# EAGLE design filterboard (EAGLE 5.11)
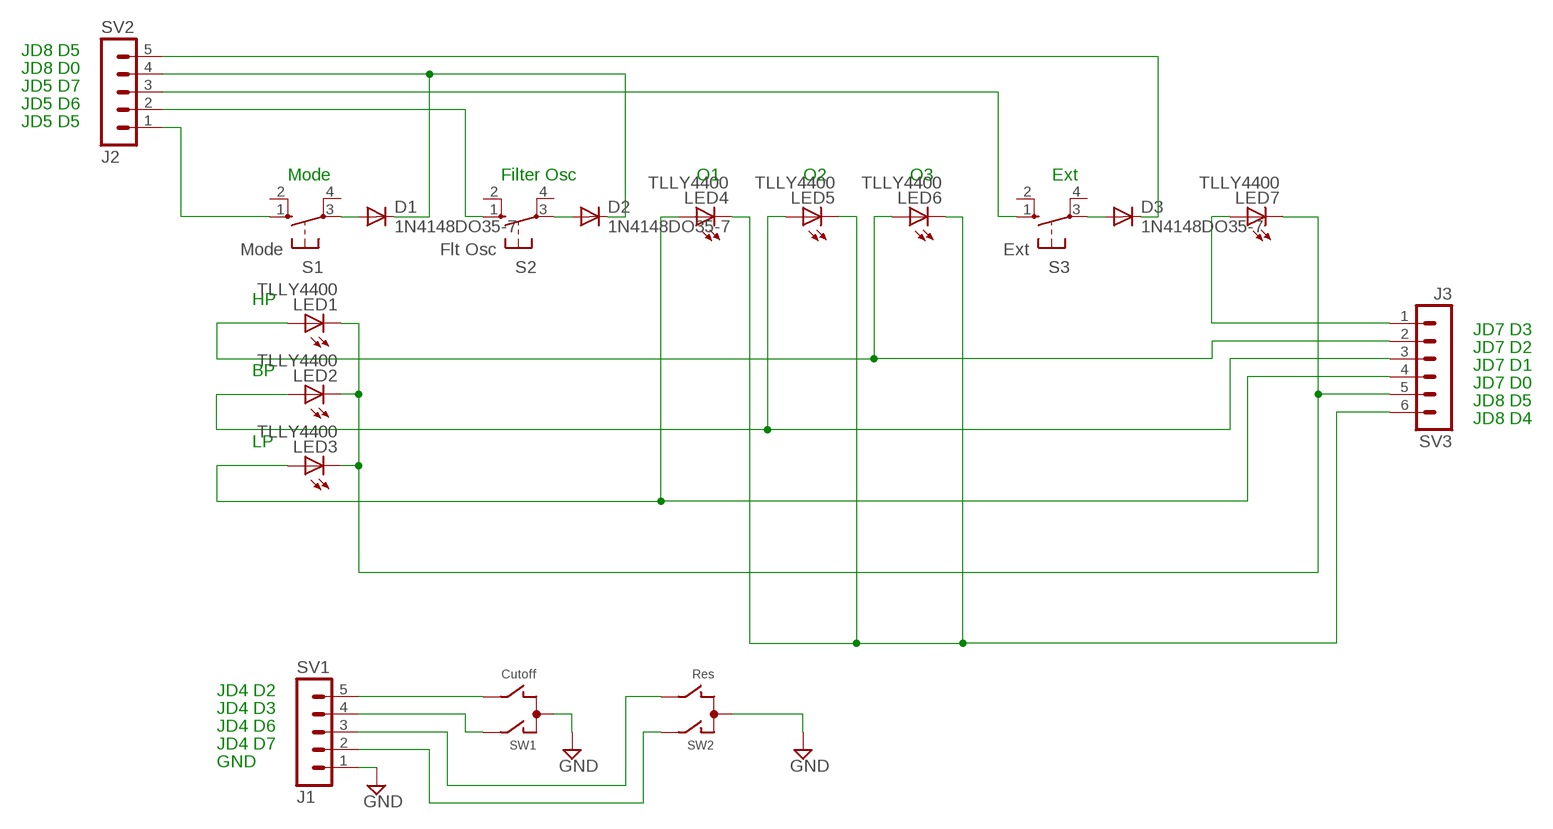
[diagram p0: schematic, sheet 1]

## Parts
D1  1N4148DO35-7  [DO35-7]
D2  1N4148DO35-7  [DO35-7]
D3  1N4148DO35-7  [DO35-7]
LED1  TLLY4400  [LED3MM]
LED2  TLLY4400  [LED3MM]
LED3  TLLY4400  [LED3MM]
LED4  TLLY4400  [LED3MM]
LED5  TLLY4400  [LED3MM]
LED6  TLLY4400  [LED3MM]
LED7  TLLY4400  [LED3MM]
S1  Mode  10-XX  [B3F-10XX]
S2  Flt Osc  10-XX  [B3F-10XX]
S3  Ext  10-XX  [B3F-10XX]
SV1  J1  MA05-1  [MA05-1]
SV2  J2  MA05-1  [MA05-1]
SV3  J3  MA06-1  [MA06-1]
SW1  Cutoff  EC12E_SW  [ALPS_EC12E_SW]
SW2  Res  EC12E_SW  [ALPS_EC12E_SW]

## Nets
GND: SV1.1 SW1.C SW2.C
N$1: SV1.5 SW1.B
N$2: SV1.4 SW1.A
N$3: SV1.3 SW2.B
N$4: SV1.2 SW2.A
N$5: S1.1(S) SV2.1
N$6: D1.A S1.3(P)
N$7: S2.1(S) SV2.2
N$8: S3.1(S) SV2.3
N$9: D1.C D2.C SV2.4
N$10: D2.A S2.3(P)
N$11: LED1.K(C) LED2.K(C) LED3.K(C) LED7.K(C) SV3.5
N$12: D3.A S3.3(P)
N$13: D3.C SV2.5
N$14: LED1.A LED6.A SV3.2
N$15: LED2.A LED5.A SV3.3
N$16: LED4.K(C) LED5.K(C) LED6.K(C) SV3.6
N$20: LED7.A SV3.1
N$24: LED3.A LED4.A SV3.4
Unconnected: S1.2(S1) S1.4(P1) S2.2(S1) S2.4(P1) S3.2(S1) S3.4(P1) SW1.D SW1.E SW1.GND1(G) SW1.GND2(G) SW2.D SW2.E SW2.GND1(G) SW2.GND2(G)

## Notes on the sheet
- JD8 D5
- JD8 D0
- JD5 D7
- JD5 D6
- JD5 D5
- Mode | Filter Osc | O1 | O2 | O3 | Ext
- HP
- JD7 D3
- JD7 D2
- JD7 D1
- BP | JD7 D0
- JD8 D5
- JD8 D4
- LP
- JD4 D2
- JD4 D3
- JD4 D6
- JD4 D7
- GND

## Library data of the parts
D1-D3 = diode:1N4148: DIODE high speed (Philips)
LED1-LED7 = led:TLLY4400: Low Current (2mA) LED 3 mm Tinted Diffused Package color YELLOW Source: Data sheet <http://www.farnell.com/datasheets/391098.pdf>; MF: VISHAY SEMICONDUCTOR; OC_FARNELL: 1612439
S1-S3 = switch-omron:10-XX: OMRON SWITCH; MPN: B3F-1000; OC_FARNELL: 176432; OC_NEWARK: 36M3542
SV1 SV2 = con-lstb:MA05-1: PIN HEADER; OC_FARNELL: unknown; OC_NEWARK: unknown
SV3 = con-lstb:MA06-1: PIN HEADER; OC_FARNELL: unknown; OC_NEWARK: unknown
SW1 SW2 = switch-alps:EC12E_SW: ALPS rotary Encoder EC12E series with switch; MPN: EC12E2424407; OC_FARNELL: 1520813; OC_NEWARK: 74M1068

## Board
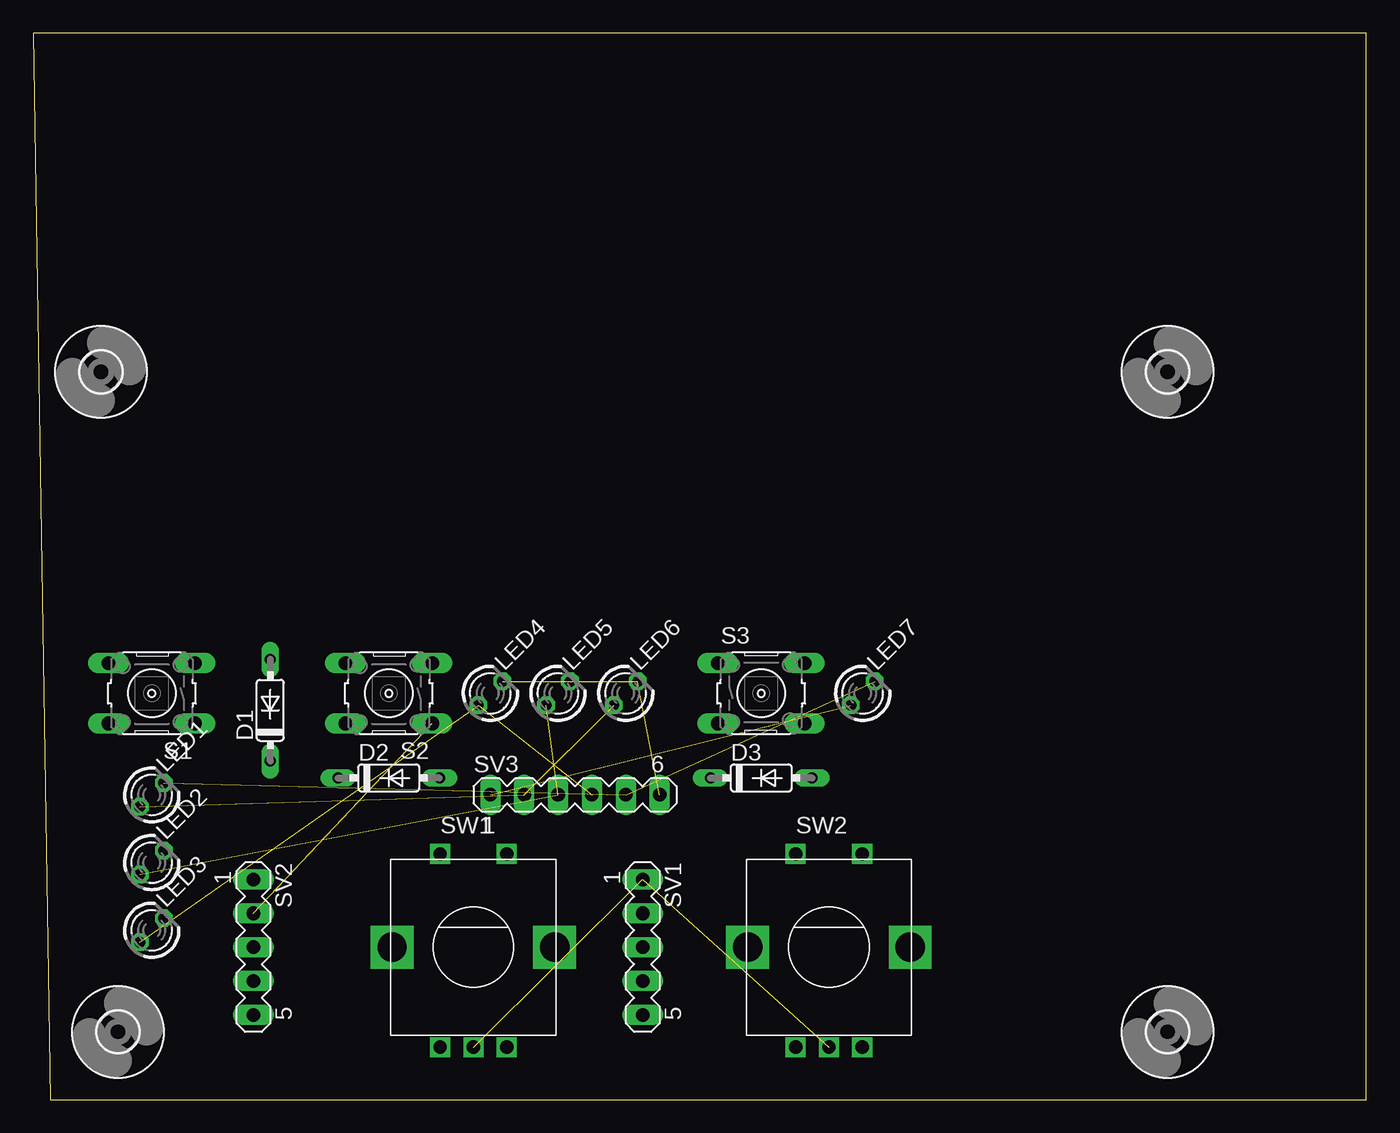
[diagram p1: board, top side]
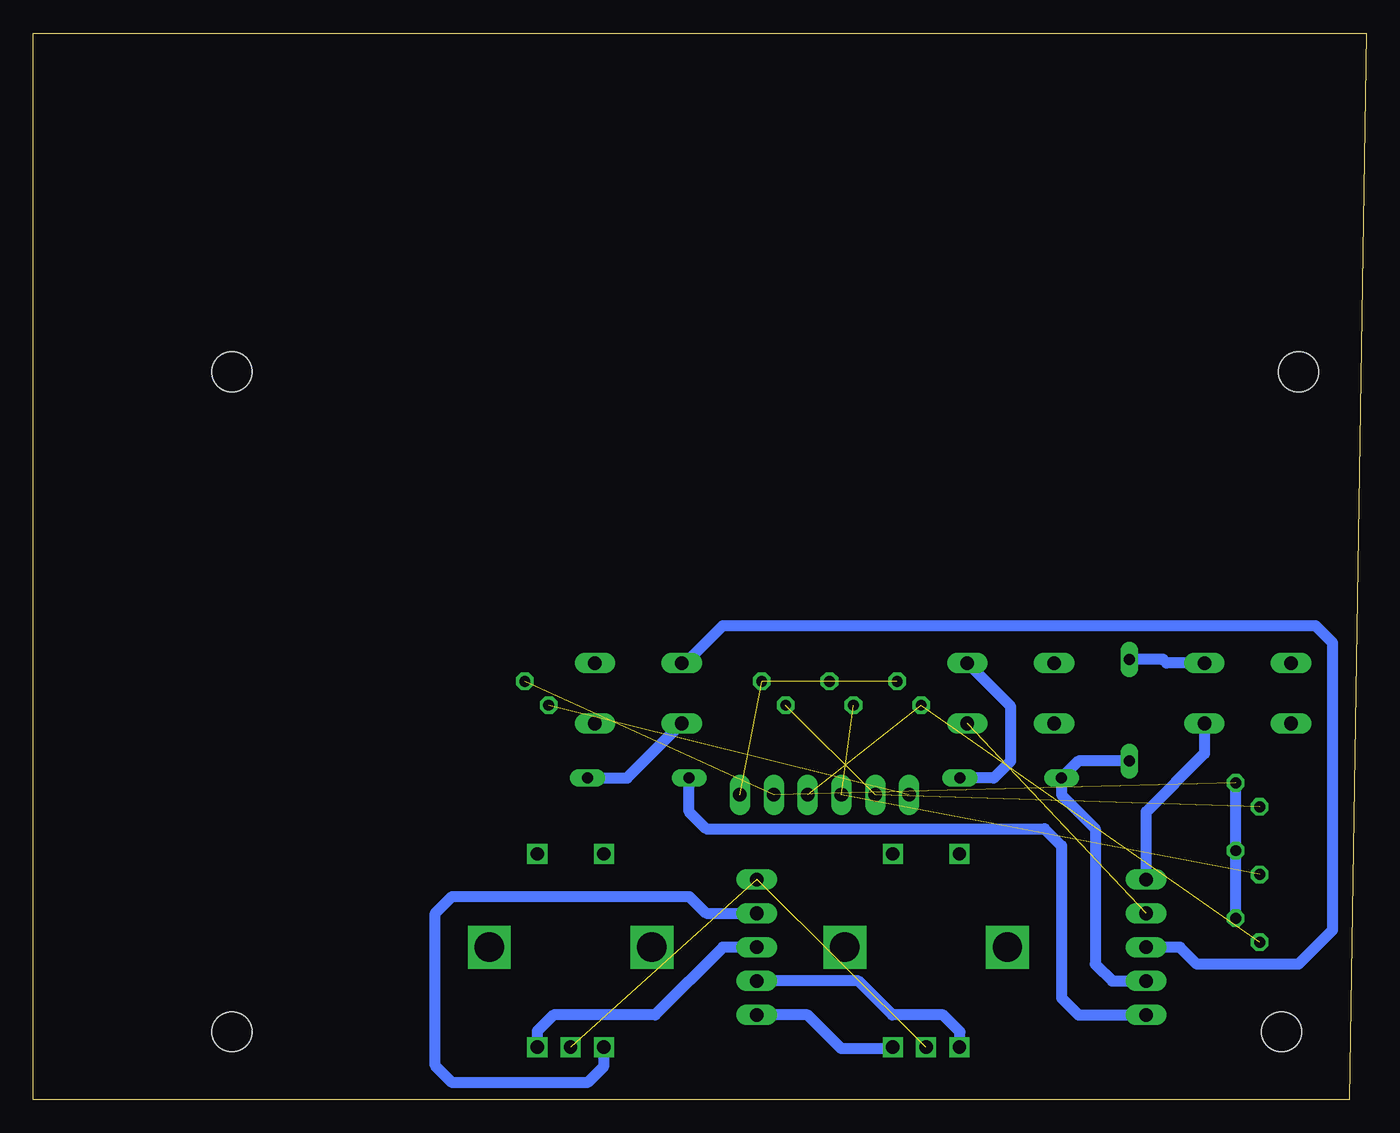
[diagram p2: board, bottom side, seen from below]

Size 100 x 80 mm. Coordinates in mm from the lower left corner, seen from the top.
Outline: 1.27,0 100,0 100,80 0,80 1.27,0
Copper layers (1*16): Top 0.035mm / dielectric 1.5mm / Bottom 0.035mm
Design rules "default": minimum track width 10mil, minimum drill 24mil, track to track 8mil, track to pad 8mil, pad to pad 8mil, via to via 8mil, smd to smd 8mil, copper to edge 40mil, drill to drill 8mil, minimum pad ring 10mil, minimum via ring 8mil, stop-mask expansion 4mil, vias tented up to drill 0mil, thermal gap 10mil

### Footprints (pad centres in the part's own frame; a part is rotated, then mirrored left to right if it is on the bottom)
DO35-7 = drill 0.813 long: A 3.81,0; C -3.81,0
LED3MM = drill 0.813 octagon: A -1.27,0; K 1.27,0
B3F-10XX = drill 1.016 long: 1 -3.251,2.261; 2 3.251,2.261; 3 -3.251,-2.261; 4 3.251,-2.261
MA05-1 = drill 1.016 long: 1 -5.08,0; 2 -2.54,0; 3 0,0; 4 2.54,0; 5 5.08,0
MA06-1 = drill 1.016 long: 1 -6.35,0; 2 -3.81,0; 3 -1.27,0; 4 1.27,0; 5 3.81,0; 6 6.35,0
ALPS_EC12E_SW = drill 1 square: A -2.5,-7.5; B 2.5,-7.5; C 0,-7.5; D -2.5,7; E 2.5,7 | drill 2.2 square: GND1 -6.1,0; GND2 6.1,0
3,0 = hole 3: 0,0

### Placement (x,y rotation side)
D1  17.78,29.21 90 top
D2  26.67,24.13 0 top
D3  54.61,24.13 0 top
LED1  8.89,22.86 45 top
LED2  8.89,17.78 45 top
LED3  8.89,12.7 45 top
LED4  34.29,30.48 45 top
LED5  39.37,30.48 45 top
LED6  44.45,30.48 45 top
LED7  62.23,30.48 45 top
S1  8.89,30.48 180 top
S2  26.67,30.48 180 top
S3  54.61,30.48 0 top
SV1  45.72,11.43 270 top
SV2  16.51,11.43 270 top
SV3  40.64,22.86 0 top
SW1  33.02,11.43 0 top
SW2  59.69,11.43 0 top
U$1  [3,0]  6.35,5.08 0 top
U$2  [3,0]  5.08,54.61 0 top
U$3  [3,0]  85.09,54.61 0 top
U$4  [3,0]  85.09,5.08 0 top

### Tracks (layer width: path | path; a pad name or v marks a point on that pad's centre or on a via)
GND  (2 unrouted)
N$1
  Bottom 0.813: SV1.5 41.91,6.35 39.37,3.81 35.64,3.81 SW1.B
N$2
  Bottom 0.813: SV1.4 38.1,8.89 35.56,6.35 31.75,6.35 30.48,5.08 30.48,3.97 SW1.A
N$3
  Bottom 0.813: SW2.B 62.19,5.12 60.96,6.35 53.34,6.35 48.26,11.43 SV1.3
N$4
  Bottom 0.813: SW2.A 57.19,2.5 58.42,1.27 68.58,1.27 69.85,2.54 69.85,13.97 68.58,15.24 50.8,15.24 49.53,13.97 SV1.2
N$5
  Bottom 0.813: SV2.1 16.51,21.59 12.14,25.96 S1.1
N$6
  Bottom 0.813: S1.3 14.96,32.74 15.24,33.02 D1.A
N$7  (1 unrouted)
N$8
  Bottom 0.813: S3.1 51.08,32.74 48.26,35.56 3.81,35.56 2.54,34.29 2.54,12.7 5.08,10.16 12.7,10.16 13.97,11.43 SV2.3
N$9
  Bottom 0.813: D1.C 21.59,25.4 D2.C 22.86,22.86 20.32,20.32 20.32,10.16 19.05,8.89 SV2.4
N$10
  Bottom 0.813: D2.A 27.94,24.13 26.67,25.4 26.67,29.49 S2.3
N$11  (2 unrouted)
  Bottom 0.813: LED1.K LED2.K LED3.K
N$12
  Bottom 0.813: D3.A 55.45,24.13 S3.3
N$13
  Bottom 0.813: D3.C 50.8,21.59 49.53,20.32 24.13,20.32 22.86,19.05 22.86,7.62 21.59,6.35 SV2.5
N$14  (2 unrouted)
N$15  (2 unrouted)
N$16  (3 unrouted)
N$20  (1 unrouted)
N$24  (2 unrouted)